# EasyEDA Pro project 重力怀表.epro, board PCB1
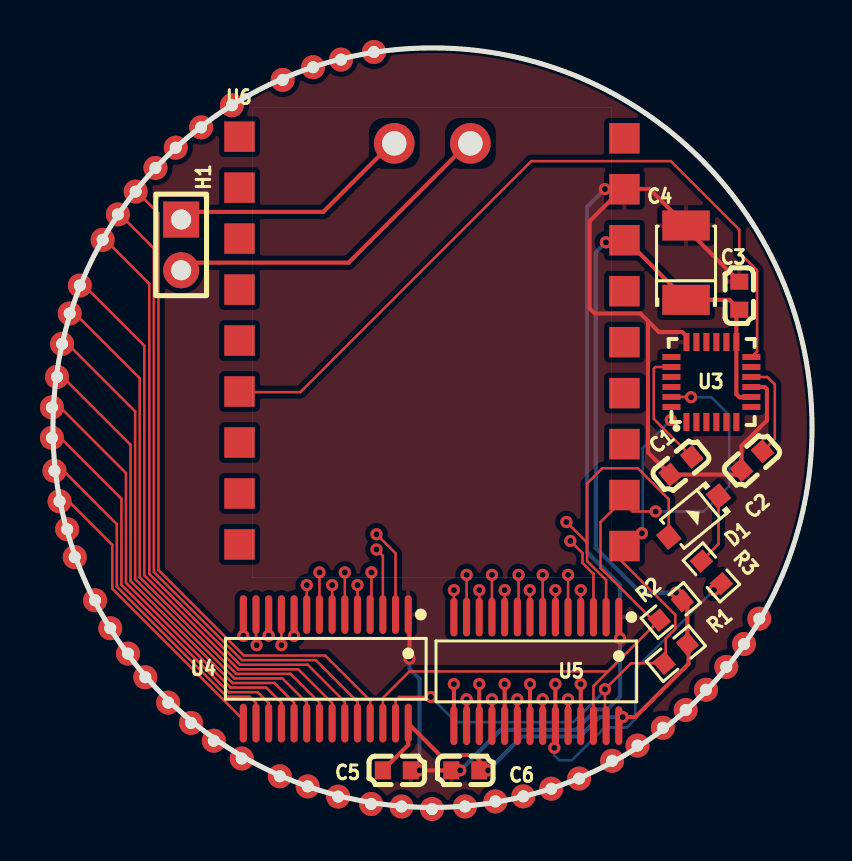
[diagram p1: board, top side]
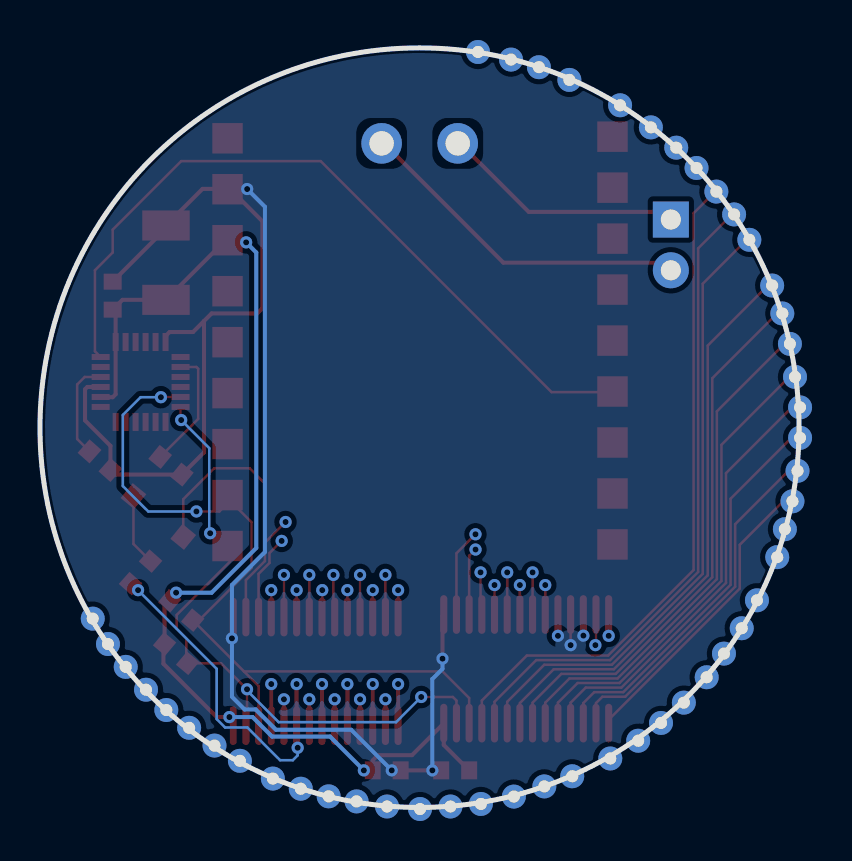
[diagram p2: board, bottom side, seen from below]

Outline 38 x 38 mm; copper layers: Top Layer, Inner1, Inner2, Bottom Layer. Coordinates in mm from the lower left corner of the outline.
Outline path: circle c19,19 r19
Stack: Top Layer 0.035mm / Dielectric1 1.51mm FR4 er 4.5 / Inner1 0.035mm / Dielectric2 0.48mm PP er 4.5 / Inner2 0.035mm / Dielectric3 0.48mm PP er 4.5 / Bottom Layer 0.035mm

## Design rules (mm)
template: JLCPCB Capability(Two Layers Board)
spacing copperThickness1oz (default): track to track 0.102, other pairs 0.152 to 0.3
spacing copperThickness2oz: track to track 0.203, other pairs 0.152 to 0.3
track width copperThickness1oz (default): min 0.127, default 0.254, max 2.54
track width copperThickness2oz: min 0.203, default 0.254, max 2.54
differential pair differentialPair (default): width min 0.127, default 0.254, max 2.54; gap min 0.152, default 0.152
via viaSize (default): diameter min 0.5, default 0.61, max 10; hole min 0.3, default 0.305, max 6.3

## Placement (name value [footprint] x y rotation side)
C1  2.2nf  [C0603]  31.44 17.09 219.2 top
C2  100nF  [C0603]  34.99 17.35 41.6 top
C3  100nF  [C0603]  34.36 25.6 90 top
C4  10uf  [CASE-B_3528]  31.69 27.25 90 top
C5  100nF  [C0603]  17.21 1.86 0 top
C6  100nF  [C0603]  20.64 1.86 180 top
D1  1N4148W  [SOD-123_L2.7-W1.6-LS3.7-FD]  32.07 14.56 39.3 top
H1  -  [HDR-TH_2P-P2.54-V-M-1]  6.42 28.14 270 top
NOREF  -  [Pad_e1449]  -0.05 20.02 0 top
NOREF#2  -  [Pad_e1453]  0.46 23.19 0 top
NOREF#3  -  [Pad_e1452]  0.33 15.32 0 top
NOREF#4  -  [Pad_e1458]  2.11 10.36 0 top
NOREF#5  -  [Pad_e1470]  8.05 3.34 0 top
NOREF#6  -  [Pad_e1471]  8.96 35.13 0 top
NOREF#7  -  [Pad_e1482]  18.98 -0.08 0 top
NOREF#8  -  [Pad_e1494]  34.6 8.18 0 top
NOREF#9  -  [Pad_e1465]  5.13 31.99 0 top
NOREF#10  -  [Pad_e1477]  14.28 0.54 0 top
NOREF#11  -  [Pad_e1492]  32.69 5.89 0 top
NOREF#12  -  [Pad_e1469]  7.42 34.02 0 top
NOREF#13  -  [Pad_e1464]  4.62 6.51 0 top
NOREF#14  -  [Pad_e1463]  4.14 30.81 0 top
NOREF#15  -  [Pad_e1486]  24.94 0.94 0 top
NOREF#16  -  [Pad_e1488]  27.99 2.33 0 top
NOREF#17  -  [Pad_e1475]  12.75 1.05 0 top
NOREF#18  -  [Pad_e1480]  16.07 37.8 0 top
NOREF#19  -  [Pad_e1467]  6.15 33.01 0 top
NOREF#20  -  [Pad_e1489]  29.26 3.1 0 top
NOREF#21  -  [Pad_e1462]  3.76 7.7 0 top
NOREF#22  -  [Pad_e1478]  14.42 37.42 0 top
NOREF#23  -  [Pad_e1456]  1.09 12.52 0 top
NOREF#24  -  [Pad_e1487]  26.34 1.45 0 top
NOREF#25  -  [Pad_e1460]  2.87 8.97 0 top
NOREF#26  -  [Pad_e1450]  0.08 16.84 0 top
NOREF#27  -  [Pad_e1493]  33.71 7.03 0 top
NOREF#28  -  [Pad_e1468]  6.91 4.23 0 top
NOREF#29  -  [Pad_e1451]  0.2 21.54 0 top
NOREF#30  -  [Pad_e1459]  2.49 28.4 0 top
NOREF#31  -  [Pad_e1454]  0.71 13.92 0 top
NOREF#32  -  [Pad_e1481]  17.45 0.05 0 top
NOREF#33  -  [Pad_e1476]  13.02 37.03 0 top
NOREF#34  -  [Pad_e1484]  22.15 0.3 0 top
NOREF#35  -  [Pad_e1466]  5.77 5.24 0 top
NOREF#36  -  [Pad_e1455]  0.84 24.72 0 top
NOREF#37  -  [Pad_e1472]  9.45 2.45 0 top
NOREF#38  -  [Pad_e1457]  1.35 26.11 0 top
NOREF#39  -  [Pad_e1473]  11.36 1.56 0 top
NOREF#40  -  [Pad_e1461]  3.25 29.67 0 top
NOREF#41  -  [Pad_e1495]  35.36 9.45 0 top
NOREF#42  -  [Pad_e1448]  -0.05 18.49 0 top
NOREF#43  -  [Pad_e1479]  15.93 0.17 0 top
NOREF#44  -  [Pad_e1483]  20.63 0.05 0 top
NOREF#45  -  [Pad_e1490]  30.53 3.98 0 top
NOREF#46  -  [Pad_e1485]  23.55 0.56 0 top
NOREF#47  -  [Pad_e1474]  11.5 36.4 0 top
NOREF#48  -  [Pad_e1491]  31.68 4.87 0 top
R1  3.3k  [R0603]  31.18 7.7 40 top
R2  3.3k  [R0603]  30.93 9.86 40 top
R3  39k  [R0603]  32.96 11.76 131.6 top
U3  MPU6050  [QFN-24_L4.0-W4.0-P0.50-BL]  32.96 21.29 0 top
U4  HT16K33A-28SSOP  [SSOP-28_L9.9-W3.9-P0.64-LS6.0-BL]  13.66 6.94 180 top
U5  HT16K33A-28SSOP  [SSOP-28_L9.9-W3.9-P0.64-LS6.0-BL]  24.2 6.81 180 top
U6  -  [esp32 suoermini s3]  9.98 35 0 top

## Footprints (pads in the part's own frame, mm; a bottom-side part is the same pattern mirrored in y, then rotated)
C0603
  rect 0.8x0.9 smd: 1(-0.7,0) 2(0.7,0)
CASE-B_3528
  rect 1.506x2.376 smd: 1(-1.861,0) 2(1.861,0)
esp32 suoermini s3
  rrect 2.032x2.032 hole 1.219: 1(7.112,-1.778) 2(10.922,-1.778)
  rect 1.524x1.524 smd: 3(-0.635,-1.444) 4(-0.635,-3.994) 5(-0.635,-6.544) 6(-0.635,-9.094) 7(-0.635,-11.644) 8(-0.635,-14.194) 9(-0.635,-16.744) 10(-0.635,-19.294) 11(-0.635,-21.844) 12(18.635,-21.924) 13(18.635,-19.374) 14(18.635,-16.824) 15(18.635,-14.274) 16(18.635,-11.724) 17(18.635,-9.174) 18(18.635,-6.624) 19(18.635,-4.074) 20(18.635,-1.524)
HDR-TH_2P-P2.54-V-M-1
  rect 1.8x1.8 hole 1: 1(-1.27,0)
  round 1.8 hole 1: 2(1.27,0)
Pad_e1448
  round 1.2 hole 0.6: 7(0,0)
Pad_e1449
  round 1.2 hole 0.6: 8(0,0)
Pad_e1450
  round 1.2 hole 0.6: 6(0,0)
Pad_e1451
  round 1.2 hole 0.6: 9(0,0)
Pad_e1452
  round 1.2 hole 0.6: 5(0,0)
Pad_e1453
  round 1.2 hole 0.6: 10(0,0)
Pad_e1454
  round 1.2 hole 0.6: 4(0,0)
Pad_e1455
  round 1.2 hole 0.6: 11(0,0)
Pad_e1456
  round 1.2 hole 0.6: 3(0,0)
Pad_e1457
  round 1.2 hole 0.6: 12(0,0)
Pad_e1458
  round 1.2 hole 0.6: 2(0,0)
Pad_e1459
  round 1.2 hole 0.6: 13(0,0)
Pad_e1460
  round 1.2 hole 0.6: 1(0,0)
Pad_e1461
  round 1.2 hole 0.6: 14(0,0)
Pad_e1462
  round 1.2 hole 0.6: 1(0,0)
Pad_e1463
  round 1.2 hole 0.6: 15(0,0)
Pad_e1464
  round 1.2 hole 0.6: 5(0,0)
Pad_e1465
  round 1.2 hole 0.6: 1(0,0)
Pad_e1466
  round 1.2 hole 0.6: 4(0,0)
Pad_e1467
  round 1.2 hole 0.6: 2(0,0)
Pad_e1468
  round 1.2 hole 0.6: 3(0,0)
Pad_e1469
  round 1.2 hole 0.6: 3(0,0)
Pad_e1470
  round 1.2 hole 0.6: 2(0,0)
Pad_e1471
  round 1.2 hole 0.6: 4(0,0)
Pad_e1472
  round 1.2 hole 0.6: 1(0,0)
Pad_e1473
  round 1.2 hole 0.6: 3(0,0)
Pad_e1474
  round 1.2 hole 0.6: 5(0,0)
Pad_e1475
  round 1.2 hole 0.6: 2(0,0)
Pad_e1476
  round 1.2 hole 0.6: 6(0,0)
Pad_e1477
  round 1.2 hole 0.6: 1(0,0)
Pad_e1478
  round 1.2 hole 0.6: 7(0,0)
Pad_e1479
  round 1.2 hole 0.6: 15(0,0)
Pad_e1480
  round 1.2 hole 0.6: 8(0,0)
Pad_e1481
  round 1.2 hole 0.6: 14(0,0)
Pad_e1482
  round 1.2 hole 0.6: 13(0,0)
Pad_e1483
  round 1.2 hole 0.6: 12(0,0)
Pad_e1484
  round 1.2 hole 0.6: 11(0,0)
Pad_e1485
  round 1.2 hole 0.6: 10(0,0)
Pad_e1486
  round 1.2 hole 0.6: 9(0,0)
Pad_e1487
  round 1.2 hole 0.6: 8(0,0)
Pad_e1488
  round 1.2 hole 0.6: 7(0,0)
Pad_e1489
  round 1.2 hole 0.6: 6(0,0)
Pad_e1490
  round 1.2 hole 0.6: 5(0,0)
Pad_e1491
  round 1.2 hole 0.6: 4(0,0)
Pad_e1492
  round 1.2 hole 0.6: 3(0,0)
Pad_e1493
  round 1.2 hole 0.6: 2(0,0)
Pad_e1494
  round 1.2 hole 0.6: 2(0,0)
Pad_e1495
  round 1.2 hole 0.6: 1(0,0)
QFN-24_L4.0-W4.0-P0.50-BL
  rect 0.3x0.9 smd: 1(-1.25,-2) 2(-0.75,-2) 3(-0.25,-2) 4(0.25,-2) 5(0.75,-2) 6(1.25,-2) 13(1.25,2) 14(0.75,2) 15(0.25,2) 16(-0.25,2) 17(-0.75,2) 18(-1.25,2)
  rect 0.9x0.3 smd: 7(2,-1.25) 8(2,-0.75) 9(2,-0.25) 10(2,0.25) 11(2,0.75) 12(2,1.25) 19(-2,1.25) 20(-2,0.75) 21(-2,0.25) 22(-2,-0.25) 23(-2,-0.75) 24(-2,-1.25)
R0603
  rect 0.806x0.864 smd: 1(-0.753,0) 2(0.753,0)
SOD-123_L2.7-W1.6-LS3.7-FD
  rect 0.88x0.96 smd: 1(-1.61,0) 2(1.61,0)
SSOP-28_L9.9-W3.9-P0.64-LS6.0-BL
  oval 0.355x1.935 smd: 1(-4.128,-2.717) 2(-3.493,-2.717) 3(-2.857,-2.717) 4(-2.223,-2.717) 5(-1.587,-2.717) 6(-0.953,-2.717) 7(-0.318,-2.717) 8(0.318,-2.717) 9(0.953,-2.717) 10(1.587,-2.717) 11(2.223,-2.717) 12(2.857,-2.717) 13(3.493,-2.717) 14(4.128,-2.717) 15(4.128,2.717) 16(3.493,2.717) 17(2.857,2.717) 18(2.223,2.717) 19(1.587,2.717) 20(0.953,2.717) 21(0.318,2.717) 22(-0.318,2.717) 23(-0.953,2.717) 24(-1.587,2.717) 25(-2.223,2.717) 26(-2.857,2.717) 27(-3.493,2.717) 28(-4.128,2.717)

## Nets
3V3: C3.1 C4.1 C5.1 C6.1 R1.2 R2.2 U3.8 U3.13 U4.28 U5.28 U6.18
GND: C1.2 C2.1 C3.2 C4.2 C5.2 C6.2 U3.9 U3.18 U4.1 U5.1 U6.19
2R0: NOREF#41.1 U5.25
2R1: NOREF#8.2 U5.24
2R2: NOREF#27.2 R3.1 U5.23
2R3: NOREF#11.3 U5.22
2R4: NOREF#48.4 U5.21
2R5: NOREF#45.5 U5.20
2R6: NOREF#20.6 U5.19
2R7: NOREF#16.7 U5.18
2R8: NOREF#24.8 U5.17
2R9: NOREF#15.9 U5.16
2R10: NOREF#46.10 U5.15
2R11: NOREF#34.11 U5.14
2R12: NOREF#44.12 U5.13
2R13: NOREF#7.13 U5.12
2R14: NOREF#32.14 U5.11
2R15: NOREF#43.15 U5.10
B+: H1.2 U6.2
B-: H1.1 U6.1
C0: NOREF#18.8 U4.2
C1: NOREF#22.7 U4.3
C2: NOREF#33.6 U4.4
C3: NOREF#47.5 U4.5
C4: NOREF#6.4 U4.6
C5: NOREF#12.3 U4.7
C6: NOREF#19.2 U4.8
C7: NOREF#9.1 U4.9
C8: D1.1 NOREF#13.5 U5.2
C9: NOREF#35.4 U5.3
C10: NOREF#28.3 U5.4
C11: NOREF#5.2 U5.5
C12: NOREF#37.1 U5.6
C13: NOREF#39.3 U5.7
C14: NOREF#17.2 U5.8
C15: NOREF#10.1 U5.9
GPIO4: U3.12 U6.8
R0: NOREF#14.15 U4.25
R1: NOREF#40.14 U4.24
R2: NOREF#30.13 U4.23
R3: NOREF#38.12 U4.22
R4: NOREF#36.11 U4.21
R5: NOREF#2.10 U4.20
R6: NOREF#29.9 U4.19
R7: NOREF.8 U4.18
R8: NOREF#42.7 U4.17
R9: NOREF#26.6 U4.16
R10: NOREF#3.5 U4.15
R11: NOREF#31.4 U4.14
R12: NOREF#23.3 U4.13
R13: NOREF#4.2 U4.12
R14: NOREF#25.1 U4.11
R15: NOREF#21.1 U4.10
SCK: R2.1 U3.23 U4.26 U5.26 U6.13
SDA: R1.1 U3.24 U4.27 U5.27 U6.12
$1N45682: D1.2 R3.2
$1N54662: C2.2 U3.10
$1N54743: C1.1 U3.20

Pads without a net: U3 1 2 3 4 5 6 7 11 14 15 16 17 19 21 22; U6 3 4 5 6 7 9 10 11 14 15 16 17 20

## Via types
v1: diameter 0.61, hole 0.305, Top Layer to Bottom Layer, 54 vias

## Routing (per net, layer and track width the routed paths; a pad name or vN(x,y) marks a point on that pad's centre or on a via; arc(x,y) is an arc through that point)
3V3: length 56.9
  Top Layer w0.127: C6.1 v1(21.79,1.86)
  Top Layer w0.203: U3.8 34.95,20.52 34.36,20.52 34.21,20.67 U3.13 34.21,24.76 C3.1 33.87,25.39 C4.1 28.74,28.34 28.48,28.34 ; C5.1 17.79,3.13 17.79,4.09 17.9,4.09 19.37,2.62 21.08,2.62 21.34,2.36 C6.1 ; v1(28.52,4.52) 29.15,4.52 31.82,7.19 31.82,8.12 R1.2 31.76,10.09 31.18,10.66 v1(31.18,10.75)
  Bottom Layer w0.203: v1(21.79,1.86) 23.48,3.55 26.38,3.55 27.36,4.52 v1(28.52,4.52) ; v1(27.68,28.27) 27.17,27.76 27.17,12.98 29.41,10.75 v1(31.18,10.75)
GND: length 83.9
  Top Layer w0.127: C6.2 v1(20.39,1.86)
  Top Layer w0.203: 29.79,24.33 29.41,24.72 27.12,24.72 26.87,24.97 26.87,29.33 28.48,30.95 29.86,30.95 C4.2 31.69,28.97 C3.2 ; 29.79,24.33 29.79,17.76 C1.2 34.24,16.65 C2.1 34.47,18.09 35.74,19.36 35.74,20.92 35.63,21.04 U3.9 ; 29.79,24.33 30.34,23.79 31.51,23.79 31.71,23.58 U3.18 ; C5.2 v1(18.36,1.86) C6.2 ; U4.1 17.85,9.59 v1(17.85,7.44)
  Bottom Layer w0.203: v1(18.36,1.86) 18.36,6.43 17.85,6.94 v1(17.85,7.44) ; v1(20.39,1.86) 22.42,3.89 26.19,3.89 27.2,4.9 27.76,4.9 28.39,5.54 v1(28.39,8.46) 28.39,11.13 26.74,12.78 26.74,30.05 v1(27.63,30.94)
2R0: length 13.2
  Top Layer w0.203: U5.25 v1(26.42,6.17)
  Inner2 w0.127: 35.09,9.6 34.96,9.47 28.01,9.47 26.42,7.89 v1(26.42,6.17)
2R1: length 11.1
  Top Layer w0.203: U5.24 v1(25.79,5.41)
  Inner2 w0.127: v1(25.79,5.41) 26.03,5.65 26.64,5.65 29.19,8.2 34.13,8.2 34.31,8.38
2R2: length 29.5
  Top Layer w0.127: U5.23 25.15,3.04 v1(25.1,2.99) ; v1(33.09,10.87) 33.22,10.87 33.46,11.12 R3.1
  Top Layer w0.203: v1(25.15,6.17) U5.23
  Inner2 w0.127: 33.45,7.24 29.7,7.24 27.35,4.89 25.48,4.89 25.22,5.16 25.22,5.58 25.85,6.21 25.85,6.55 25.6,6.81 25.41,6.81 25.15,6.55 v1(25.15,6.17)
  Bottom Layer w0.127: v1(33.09,10.87) 29.15,6.94 29.15,4.42 28.73,4 27.62,4 25.98,2.36 25.34,2.36 25.1,2.61 v1(25.1,2.99)
2R3: length 11.2
  Top Layer w0.203: U5.22 v1(24.52,5.41)
  Inner2 w0.127: v1(24.52,5.41) 24.52,5.79 24.61,5.88 24.71,5.88 24.92,5.67 24.92,5 25.27,4.66 27.44,4.66 28.9,6.11 32.46,6.11
2R4: length 13.2
  Top Layer w0.203: v1(23.88,6.17) U5.21
  Inner2 w0.127: 31.44,5.13 31.29,5.28 28.39,5.28 27.54,4.43 24.76,4.43 23.95,5.25 23.95,5.58 24.58,6.21 24.58,6.55 24.33,6.81 24.14,6.81 23.88,6.55 v1(23.88,6.17)
2R5: length 10.1
  Top Layer w0.203: U5.20 v1(23.25,5.41)
  Inner2 w0.127: 30.35,4.22 28.95,4.22 28.73,4 24.66,4 23.65,5 23.65,5.67 23.44,5.88 23.34,5.88 23.25,5.79 v1(23.25,5.41)
2R6: length 12.2
  Top Layer w0.203: v1(22.61,6.17) U5.19
  Inner2 w0.127: v1(22.61,6.17) 22.61,6.55 22.87,6.81 23.06,6.81 23.31,6.55 23.31,6.22 22.68,5.58 22.68,5.25 24.15,3.77 25.01,3.77 25.03,3.76 28.69,3.76 29.1,3.34
2R7: length 9.5
  Top Layer w0.203: U5.18 v1(21.98,5.41)
  Inner2 w0.127: 27.85,2.6 27.71,2.47 24.88,2.47 22.38,4.97 22.38,5.67 22.17,5.88 22.07,5.88 21.98,5.79 v1(21.98,5.41)
2R8: length 11.2
  Top Layer w0.203: v1(21.34,6.17) U5.17
  Inner2 w0.127: 26.19,1.81 24.84,1.81 21.41,5.25 21.41,5.58 22.04,6.22 22.04,6.55 21.79,6.81 21.53,6.81 21.34,6.62 v1(21.34,6.17)
2R9: length 8.6
  Top Layer w0.203: U5.16 v1(20.71,5.41)
  Inner2 w0.127: 24.82,1.3 24.12,1.3 21.11,4.31 21.11,5.67 20.9,5.88 20.8,5.88 20.71,5.79 v1(20.71,5.41)
2R10: length 10.7
  Top Layer w0.203: U5.15 v1(20.07,6.17)
  Inner2 w0.127: v1(20.07,6.17) 20.07,6.62 20.26,6.81 20.52,6.81 20.77,6.55 20.77,6.21 20.14,5.58 20.14,4.52 23.46,1.2 23.46,0.91
2R11: length 14.1
  Top Layer w0.127: U5.14 v1(20.07,10.87)
  Inner2 w0.127: v1(20.07,10.87) 20.07,11.25 19.94,11.38 19.63,11.38 19.5,11.25 19.5,4.01 21.02,2.49 21.02,1.78 22.1,0.7 22.1,0.62
2R12: length 16.7
  Top Layer w0.127: U5.13 v1(20.71,11.63)
  Inner2 w0.127: 20.59,0.43 18.4,2.63 18.4,6.08 19.27,6.96 19.27,11.79 19.59,12.11 20.62,12.11 20.71,12.02 v1(20.71,11.63)
2R13: length 17.6
  Top Layer w0.127: U5.12 v1(21.34,10.87)
  Inner2 w0.127: v1(21.34,10.87) 21.34,11.95 20.9,12.4 19.56,12.4 19.04,11.88 19.04,7.06 17.84,5.85 17.84,1.64 18.98,0.5 18.98,0.36
2R14: length 18.3
  Top Layer w0.127: U5.11 v1(21.98,11.63)
  Inner2 w0.127: v1(21.98,11.63) 21.98,12.08 21.43,12.62 19.46,12.62 18.81,11.98 18.81,7.15 17.48,5.82 17.48,0.42
2R15: length 19.8
  Top Layer w0.127: U5.10 v1(22.61,10.87)
  Inner2 w0.127: 16,0.61 16,4.66 18.58,7.24 18.58,12.07 19.37,12.85 21.84,12.85 22.61,12.08 v1(22.61,10.87)
B+: length 17.2
  Top Layer w0.203: H1.2 6.8,27.25 14.8,27.25 20.9,33.35
B-: length 12.3
  Top Layer w0.203: H1.1 6.8,29.8 13.53,29.8 17.09,33.35
C0: length 33.3
  Top Layer w0.127: v1(16.2,13.67) 17.15,12.71 U4.2
  Inner1 w0.127: 16.13,37.41 16.07,37.36 16.07,35.69 10.64,30.26 10.64,18.25 15.22,13.67 v1(16.2,13.67)
C1: length 32
  Top Layer w0.127: U4.3 16.52,12.58 v1(16.2,12.9)
  Inner1 w0.127: 14.5,37.09 14.5,34.45 10.41,30.36 10.41,18.15 15.66,12.9 v1(16.2,12.9)
C2: length 30.7
  Top Layer w0.127: U4.4 15.94,9.72 v1(15.94,11.76)
  Inner1 w0.127: v1(15.94,11.76) 15.94,12.3 10.18,18.06 10.18,30.45 13.14,33.41 13.14,36.69
C3: length 29.3
  Top Layer w0.127: U4.5 v1(15.25,11.13)
  Inner1 w0.127: v1(15.25,11.13) 15.25,12.67 9.95,17.96 9.95,30.55 11.62,32.22 11.62,36.11
C4: length 27.9
  Top Layer w0.127: U4.6 v1(14.61,11.76)
  Inner1 w0.127: 9.15,34.77 9.15,30.5 9.73,29.93 9.73,17.87 14.61,12.98 v1(14.61,11.76) ; 9.15,34.77 8.96,34.96 NOREF#6.4 ; 9.15,34.77 9.15,34.82
C5: length 26.8
  Top Layer w0.127: U4.7 v1(13.98,11.13)
  Inner1 w0.127: 7.62,33.76 7.56,33.7 7.56,31.77 9.5,29.84 9.5,17.77 13.98,13.29 v1(13.98,11.13)
C6: length 26
  Top Layer w0.127: U4.8 v1(13.34,11.76)
  Inner1 w0.127: 6.4,32.73 6.4,32.61 9.27,29.74 9.27,17.68 13.34,13.6 v1(13.34,11.76)
C7: length 26
  Top Layer w0.127: U4.9 v1(12.71,11.13)
  Inner1 w0.127: v1(12.71,11.13) 12.71,13.91 9.04,17.58 9.04,29.65 6.94,31.74 5.4,31.74
C8: length 41.7
  Top Layer w0.127: D1.1 30.83,15.42 29.28,16.97 27.5,16.97 26.74,16.21 26.74,13.25 ; 26.74,13.25 v1(25.7,14.28) ; 26.74,13.25 26.74,12.33 27.69,11.37 U5.2
  Inner2 w0.127: 4.93,6.78 14.18,6.78 16.75,9.35 16.75,12.83 18.61,14.69 25.3,14.69 v1(25.7,14.28)
C9: length 30.3
  Top Layer w0.127: U5.3 27.06,11.69 26.51,12.23 26.51,12.73 v1(25.9,13.34)
  Inner2 w0.127: 6.08,5.56 13.29,5.56 16.98,9.25 16.98,12.73 18.7,14.46 24.78,14.46 v1(25.9,13.34)
C10: length 28.7
  Top Layer w0.127: U5.4 v1(26.42,10.87)
  Inner2 w0.127: v1(26.42,10.87) 26.42,12.08 24.27,14.23 18.8,14.23 17.21,12.64 17.21,9.16 12.62,4.57 7.19,4.57
C11: length 27.1
  Top Layer w0.127: U5.5 v1(25.79,11.63)
  Inner2 w0.127: v1(25.79,11.63) 25.79,12.08 23.87,14 18.89,14 17.44,12.55 17.44,9.06 12.1,3.72 8.32,3.72
C12: length 25.3
  Top Layer w0.127: U5.6 v1(25.15,10.87)
  Inner2 w0.127: v1(25.15,10.87) 25.15,12.08 23.46,13.77 18.99,13.77 17.67,12.45 17.67,8.97 11.55,2.85 9.68,2.85
C13: length 23.3
  Top Layer w0.127: U5.7 v1(24.52,11.63)
  Inner2 w0.127: 11.52,1.93 11.52,2.49 17.9,8.88 17.9,12.36 19.08,13.54 23.02,13.54 24.52,12.05 v1(24.52,11.63)
C14: length 22.3
  Top Layer w0.127: v1(23.87,10.87) 23.87,9.54 U5.8
  Inner2 w0.127: v1(23.87,10.87) 23.87,12.09 22.65,13.31 19.18,13.31 18.13,12.26 18.13,8.78 12.87,3.53 12.87,1.4
C15: length 21.2
  Top Layer w0.127: U5.9 23.31,9.59 v1(23.31,11.63)
  Inner2 w0.127: v1(23.31,11.63) 23.31,12.05 22.27,13.08 19.27,13.08 18.36,12.17 18.36,8.69 14.38,4.71 14.38,0.94
GPIO4: length 38.1
  Top Layer w0.127: U3.12 35.25,22.82 35.25,26.87 34.36,27.76 34.36,28.91 30.93,32.33 23.95,32.33 12.39,20.78 9.7,20.78 9.47,20.55
R0: length 33.5
  Top Layer w0.127: U4.25 15.88,5.35 13.63,7.6 9.56,7.6 5.28,11.88 5.28,29.73 4.41,30.6
R1: length 32.2
  Top Layer w0.127: U4.24 15.25,5.28 13.16,7.37 9.46,7.37 5.05,11.78 5.05,27.97 3.57,29.45
R2: length 30.9
  Top Layer w0.127: U4.23 14.61,5.28 12.75,7.14 9.37,7.14 4.82,11.69 4.82,26.2 2.8,28.22
R3: length 28.6
  Top Layer w0.127: U4.22 13.98,5.22 12.28,6.91 9.27,6.91 4.57,11.61 4.57,23.1 1.71,25.96
R4: length 27
  Top Layer w0.127: U4.21 13.34,5.24 11.9,6.68 9.18,6.68 4.34,11.52 4.34,21.47 1.22,24.59
R5: length 25.2
  Top Layer w0.127: 0.82,23.11 4.12,19.81 4.12,11.42 9.09,6.45 11.49,6.45 12.71,5.24 U4.20
R6: length 23.3
  Top Layer w0.127: U4.19 12.07,5.24 11.09,6.22 8.99,6.22 3.89,11.33 3.89,18.14 0.53,21.5
R7: length 21.4
  Top Layer w0.127: 0.39,19.99 3.66,16.72 3.66,11.23 8.9,6 10.68,6 11.44,5.24 U4.18
R8: length 19.5
  Top Layer w0.127: U4.17 10.8,5.22 10.25,5.77 8.8,5.77 3.43,11.14 3.43,15.44 0.37,18.5
R9: length 17.3
  Top Layer w0.127: U4.16 10.17,5.22 9.85,5.54 8.71,5.54 3.2,11.04 3.2,14.17 0.48,16.89
R10: length 14.8
  Top Layer w0.127: U4.15 9.53,4.39 2.97,10.95 2.97,13.14 0.72,15.39
R11: length 12.6
  Top Layer w0.127: U4.14 v1(9.53,8.59)
  Inner2 w0.127: v1(9.53,8.59) 9.53,8.14 9.31,7.92 8.81,7.92 2.71,14.01 1.04,14.01
R12: length 12.6
  Top Layer w0.127: U4.13 10.17,8.15 v1(10.2,8.12)
  Inner2 w0.127: 1.47,12.66 3.74,12.66 8.71,7.69 9.97,7.69 10.2,7.92 v1(10.2,8.12)
R13: length 11.7
  Top Layer w0.127: v1(10.8,8.6) 10.8,9.65 U4.12
  Inner2 w0.127: v1(10.8,8.6) 10.8,7.76 10.5,7.46 8.5,7.46 5.45,10.52 2.41,10.52
R14: length 11.4
  Top Layer w0.127: U4.11 11.44,8.08
  Inner2 w0.127: v1(11.44,8.12) 11.44,7.63 11.04,7.23 8.41,7.23 6.29,9.35 3.37,9.35 3.18,9.16
R15: length 10.6
  Top Layer w0.127: U4.10 v1(12.07,8.59)
  Inner2 w0.127: v1(12.07,8.59) 12.07,7.76 11.31,7 8.13,7 7.23,7.9 4.03,7.9
SCK: length 40.6
  Top Layer w0.127: 27.79,6.81 27.06,6.08 U5.26 ; 27.79,6.81 17.85,6.81 16.52,5.47 16.52,4.09 ; 27.79,6.81 30.35,9.37 30.03,9.37 27.51,11.89 27.5,11.89 27.41,11.98 27.41,14.27 28.48,15.34 29.02,14.81 v1(30.17,14.81) ; v1(31.95,20.52) 31.93,20.54 U3.23
  Bottom Layer w0.127: v1(31.95,20.52) 32.96,20.52 33.85,19.64 33.85,16.08 32.58,14.81 v1(30.17,14.81)
SDA: length 33.6
  Top Layer w0.127: v1(29.48,13.72) 29.46,13.72 28.48,12.75 28.48,12.3 31.16,9.63 31.16,8.94 30.68,8.46 30.68,7.28 R1.1 28.93,7.21 v1(27.63,5.91) 27.63,4.15 U5.27 ; U3.24 30.96,19.41 v1(30.93,19.38) ; 17.15,4.09 17.15,5.35 17.33,5.53 v1(18.92,5.53)
  Bottom Layer w0.127: v1(18.92,5.53) 20.17,4.27 26.05,4.27 27.63,5.85 v1(27.63,5.91) ; v1(30.93,19.38) 29.52,17.97 29.52,13.92 29.48,13.88 v1(29.48,13.72)
$1N45682: length 3.6
  Top Layer w0.127: R3.2 33.32,13.18 33.32,15.57
$1N54662: length 4.9
  Top Layer w0.127: U3.10 35.76,21.54 36.14,21.16 36.14,18.43 C2.2
$1N54743: length 6.1
  Top Layer w0.127: C1.1 30.08,19.44 30.08,21.95 30.17,22.04 U3.20

## Copper pours and planes (outline as drawn; the poured copper is in the pictures)
GND on Top Layer: -7.42,38.94 39.57,38.94 39.57,-2.46 -7.42,-2.46
GND on Bottom Layer: -10.47,43.64 43,43.64 43,-7.16 -10.47,-7.16
